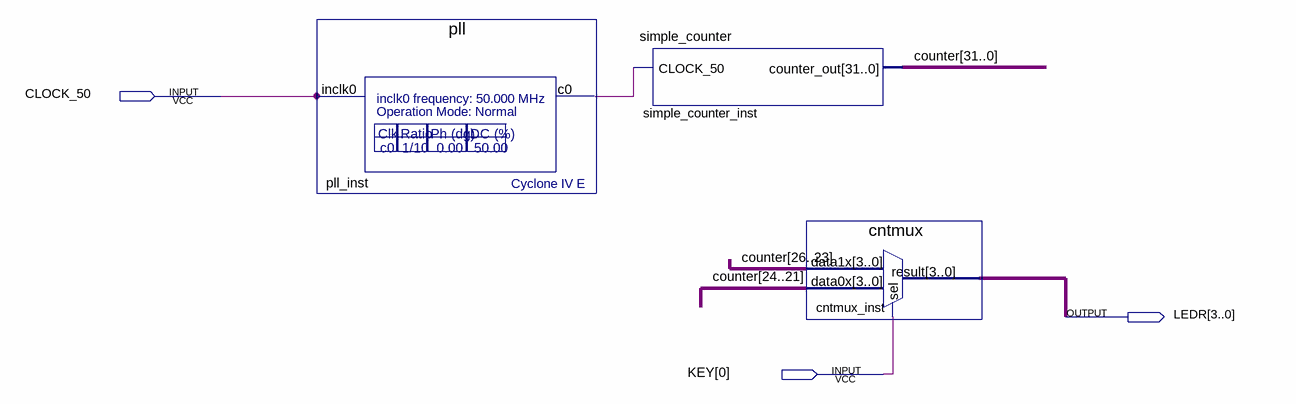
[diagram p0: schematic sheet]
// Quartus schematic my_first_fpga.bdf as structural Verilog: 3 symbols, 3 pins
module my_first_fpga (
  input  CLOCK_50,
  input  [0:0] KEY,
  output [3:0] LEDR
);

  wire pll_inst_c0;
  wire [31:0] counter;

  pll pll_inst (.inclk0(CLOCK_50), .c0(pll_inst_c0));
  simple_counter simple_counter_inst (.CLOCK_50(pll_inst_c0), .counter_out(counter));
  cntmux cntmux_inst (.data1x(counter[26:23]), .data0x(counter[24:21]), .sel(KEY[0]), .result(LEDR));
endmodule
